# EAGLE schematic meteo_1 (EAGLE 9.5.2)
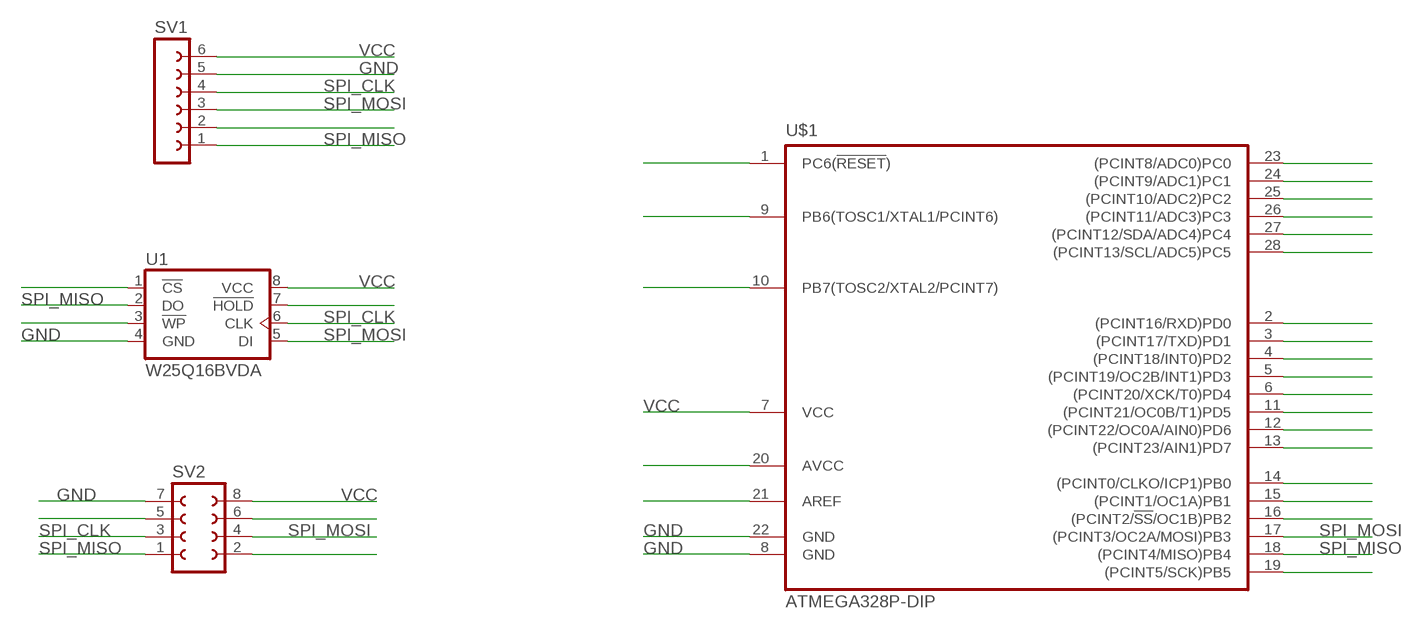
[diagram p0: schematic, sheet 1]

## Parts
SV1  FE06-1  [FE06]
SV2  FE04-2  [FE04-2]
U1  W25Q16BVDA  [DIL08]
U$1  ATMEGA328P-DIP  [DIP762W53P254L3500H508Q28B]

## Nets
GND: SV1.5 SV2.7 U1.4(GND) U$1.8(GND) U$1.22(GND)
N$1: U$1.1(PC6(!RESET!))
N$2: U$1.9(PB6(TOSC1/XTAL1/PCINT6))
N$3: U$1.10(PB7(TOSC2/XTAL2/PCINT7))
N$4: U1.1(!CS!)
N$6: U1.3(!WP!)
N$7: U$1.20(AVCC)
N$8: U1.7(!HOLD!)
N$9: U$1.21(AREF)
N$10: SV2.5
N$12: U$1.23((PCINT8/ADC0)PC0)
N$13: U$1.24((PCINT9/ADC1)PC1)
N$14: U$1.25((PCINT10/ADC2)PC2)
N$15: U$1.26((PCINT11/ADC3)PC3)
N$16: U$1.27((PCINT12/SDA/ADC4)PC4)
N$17: U$1.28((PCINT13/SCL/ADC5)PC5)
N$18: U$1.2((PCINT16/RXD)PD0)
N$19: U$1.3((PCINT17/TXD)PD1)
N$20: U$1.4((PCINT18/INT0)PD2)
N$21: U$1.6((PCINT20/XCK/T0)PD4)
N$22: U$1.5((PCINT19/OC2B/INT1)PD3)
N$23: U$1.11((PCINT21/OC0B/T1)PD5)
N$24: U$1.12((PCINT22/OC0A/AIN0)PD6)
N$25: U$1.13((PCINT23/AIN1)PD7)
N$26: U$1.14((PCINT0/CLKO/ICP1)PB0)
N$27: U$1.15((PCINT1/OC1A)PB1)
N$28: U$1.16((PCINT2/!SS!/OC1B)PB2)
N$30: U$1.19((PCINT5/SCK)PB5)
N$32: SV2.6
N$33: SV1.2
N$34: SV2.2
SPI_CLK: SV1.4 SV2.3 U1.6(CLK)
SPI_MISO: SV1.1 SV2.1 U1.2(DO) U$1.18((PCINT4/MISO)PB4)
SPI_MOSI: SV1.3 SV2.4 U1.5(DI) U$1.17((PCINT3/OC2A/MOSI)PB3)
VCC: SV1.6 SV2.8 U1.8(VCC) U$1.7(VCC)

## Library data of the parts
SV1 = con-lsta:FE06-1: FEMALE HEADER; OC_FARNELL: unknown; OC_NEWARK: unknown
SV2 = con-lsta-4x2:FE04-2: FEMALE HEADER
U1 = memory-winbond:W25Q16BV: EEPROM 4 Mbit SPI Serial Flash7
U$1 = atmel-avr:ATMEGA328P-DIP